# Altium project Stoper_Szymon_Paterak.PrjPcb
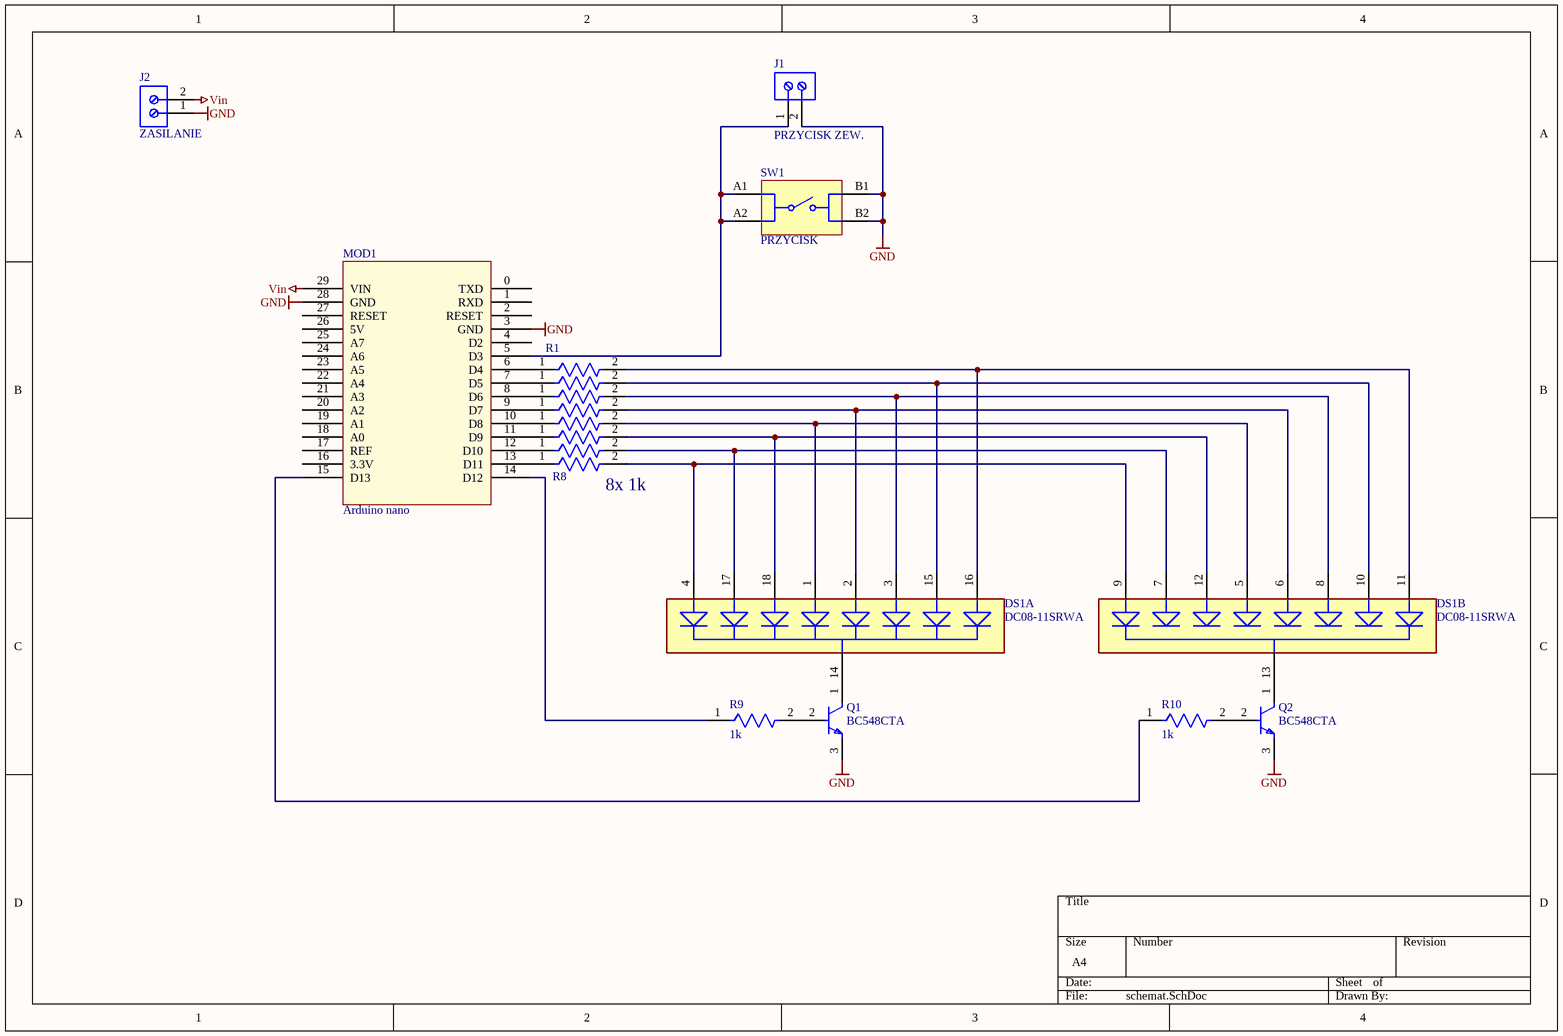
[diagram p0: schemat.SchDoc]
1 sheet, 17 parts. Net scope: global (net labels, ports and power ports of the same name join across sheets).
Board file: PCB.PcbDoc

## Sheet schemat.SchDoc
size A4; SheetNumber: 1; SheetTotal: 1

### Parts
DS1  DC08-11SRWA  [FP-DC08-11SRWA-MFG]  (parts A,B of 2)
J1  PRZYCISK ZEW.  [691102710002]
J2  ZASILANIE  [691102710002]
MOD1  Arduino nano  [Arduino nano]
Q1  BC548CTA  [FP-135AR-MFG]
Q2  BC548CTA  [FP-135AR-MFG]
R1  1k  [FP-CF18-MFG]  (value not drawn)
R2  1k  [FP-CF18-MFG]  (value not drawn)
R3  1k  [FP-CF18-MFG]  (value not drawn)
R4  1k  [FP-CF18-MFG]  (value not drawn)
R5  1k  [FP-CF18-MFG]  (value not drawn)
R6  1k  [FP-CF18-MFG]  (value not drawn)
R7  1k  [FP-CF18-MFG]  (value not drawn)
R8  1k  [FP-CF18-MFG]  (value not drawn)
R9  1k  [FP-CF18-MFG]
R10  1k  [FP-CF18-MFG]
SW1  PRZYCISK  [4304x60437x6]

### Nets
GND: J1.2 J2.1 MOD1.3(GND) MOD1.28(GND) Q1.3(E) Q2.3(E) SW1.B1 SW1.B2
Vin: J2.2 MOD1.29(VIN)
NetDS1_1: DS1.1(Anode_e_Dig1) DS1.5(Anode_e_Dig2) R5.2
NetDS1_2: DS1.2(Anode_d_Dig1) DS1.6(Anode_d_Dig2) R4.2
NetDS1_3: DS1.3(Anode_c_Dig1) DS1.8(Anode_c_Dig2) R3.2
NetDS1_4: DS1.4(Anode_Dp1_Dig1) DS1.9(Anode_Dp2_Dig2) R8.2
NetDS1_7: DS1.7(Anode_g_Dig2) DS1.17(Anode_g_Dig1) R7.2
NetDS1_10: DS1.10(Anode_b_Dig2) DS1.15(Anode_b_Dig1) R2.2
NetDS1_11: DS1.11(Anode_a_Dig2) DS1.16(Anode_a_Dig1) R1.2
NetDS1_12: DS1.12(Anode_f_Dig2) DS1.18(Anode_f_Dig1) R6.2
NetDS1_13: DS1.13(Common_Cathode_Dig2) Q2.1(C)
NetDS1_14: DS1.14(Common_Cathode_Dig1) Q1.1(C)
NetJ1_1: J1.1 MOD1.5(D3) SW1.A1 SW1.A2
NetMOD1_6: MOD1.6(D4) R1.1
NetMOD1_7: MOD1.7(D5) R2.1
NetMOD1_8: MOD1.8(D6) R3.1
NetMOD1_9: MOD1.9(D7) R4.1
NetMOD1_10: MOD1.10(D8) R5.1
NetMOD1_11: MOD1.11(D9) R6.1
NetMOD1_12: MOD1.12(D10) R7.1
NetMOD1_13: MOD1.13(D11) R8.1
NetMOD1_14: MOD1.14(D12) R9.1
NetMOD1_15: MOD1.15(D13) R10.1
NetQ1_2: Q1.2(B) R9.2
NetQ2_2: Q2.2(B) R10.2

Not connected (* = marked no-connect by the designer): MOD1 0(TXD) 1(RXD) 2(RESET) 4(D2) 16(3.3V) 17(REF) 18(A0) 19(A1) 20(A2) 21(A3) 22(A4) 23(A5) 24(A6) 25(A7) 26(5V) 27(RESET)

### Notes on the sheet
- (near R8) 8x 1k

### Library data of the parts
DS1 = CMP-44525-000001-1: DISPLAY 660NM RED 2DIG 0.8" 7SEG; Manufacturer: Kingbright; Reverse Voltage: 5V; Display Type: LED; Wavelength: 640nm; Forward Current: 20mA; Element Config: Common Cathode; Power Dissipation: 75mW; Forward Voltage: 1.85V; Luminous Intensity: 32mcd; Package: DC08-11SRWA; Temperature: -40°C to +85°C; Device Class L2: Displays; ComponentLink2Description: Datasheet; Category: Disp; Digikey Description: DISPLAY 660NM RED 2DIG 0.8" 7SEG; ComponentLink2URL: https://www.kingbrightusa.com/images/catalog/SPEC/DC08-11SRWA.pdf; Lead Free: Yes; Temperature Range High: +85°C; Test Current: 20mA; RoHS: TRUE; Height: 10.25mm; Device Class L1: Optoelectronics; Manufacturer Part Number: DC08-11SRWA; Automotive: No; Temperature Range Low: -40°C; Octopart: https://octopart.com/dc08-11srwa-kingbright-55457135; Mouser Description: LED Displays & Accessories Dual Red 640nm Common Cathode; Device Class L3: LED Displays
J1 J2 = CMP-1502-03258-2: NexarPartId: 8917706; Number of Levels: 1; Number of Positions Per Level: 2; Current: 15A; Voltage: 300V; Pitch: 5.0038mm; Plating: Steel; Stripping Length: -6mm; Wire Gauge (Min): 14AWG; Wire Gauge (Max): 22AWG; Length: 7.5mm; Contact Material: Brass; Contact Plating: Tin; Packaging: Box; Number of Pins: 2; Voltage Rating: 300V; Termination: Screw; Number of Contacts: 2; Color: Blue; Current Rating: 15A; Mount: Through Hole; Max Operating Temperature: 105°C; Min Operating Temperature: -40°C; REACH SVHC: Unknown; Height: 13.4mm; Width: 11.2mm; Housing Material: Nylon; RoHS: Compliant; Wire/Cable Gauge: 22AWG; Lead Pitch: 5mm
MOD1 = Arduino_nano
Q1 Q2 = CMP-00278-84324566-1: BC548CTA Small Signal Bipolar Transistor, 0.1A I(C), 30V V(BR)CEO, 1-Element, NPN, Silicon, TO-92; Manufacturer Lifecycle Status: ACTIVE; Max Power Dissipation: 500mW; Max Collector Current: 100mA; Max Junction Temperature (Tj): 150°C; Transition Frequency: 300MHz; Emitter Base Voltage (VEBO): 5V; hFE Min: 110; Element Configuration: Single; Collector Emitter Saturation Voltage: 250mV; Number of Elements: 1; Height: 4.58mm; Width: 3.86mm; Collector Emitter Voltage (VCEO): 30V; Schedule B: 8541210080, 8541210080; Max Operating Temperature: 150°C; REACH SVHC: No SVHC; Number of Pins: 3; Power Dissipation: 500mW; Frequency: 300MHz; Polarity: NPN; Lead Free: Lead Free; Voltage Rating (DC): 30V; Weight: 240mg; Max Breakdown Voltage: 30V; Current Rating: 100mA; NexarPartId: 84324566; Min Operating Temperature: -65°C; Collector Emitter Breakdown Voltage: 30V; Gain Bandwidth Product: 300MHz; Radiation Hardening: No; Collector Base Voltage (VCBO): 30V; RoHS: Compliant; Contact Plating: Tin; Length: 4.58mm; Lifecycle Status: Production; Case/Package: TO-92; Mount: Through Hole; Max Frequency: 300MHz
R1-R10 = CMP-26528-000002-1: RES 10K OHM 1/8W 5% CF AXIAL; Manufacturer Part Number: CF18JT10K0; Manufacturer: Stackpole Electronics; Power Rating: 0.125W; Temperature Coefficient: 0-500ppm/°C; Resistance: 10kΩ; Voltage Rating: 250V; Value: 10kΩ; Temperature: -55°C to +155°C; Height: 2mm; Lead Free: Yes; Automotive: No; Device Class L2: Resistors; Package: CF18; Series: CF; ComponentLink2Description: Datasheet; Ipc Land Pattern Name: RESAD656W65L360D200; Temperature Range High: +155°C; RoHS: TRUE; Device Class L3: Through-Hole Resistors; Temperature Range Low: -55°C; Device Class L1: Passive Components; Category: Res; Octopart: https://octopart.com/cf18jt10k0-stackpole+electronics-19205642; Composition: Carbon Film; Digikey Description: RES 10K OHM 1/8W 5% CF AXIAL; ComponentLink2URL: http://www.seielect.com/Catalog/SEI-CF_CFM.pdf; Tolerance: 5%
SW1 = CMP-1456-00007-2: NexarPartId: 31136478; Insulation Resistance: 100MΩ; Actuator Length: 800µm; Illumination Type: Illuminated, Non-Illuminated; Switch Function: Off-Mom; Mechanical Life: 500kcycles; Voltage Rating: 12V; Switch Travel: 300µm; Actuator Material: Liquid Crystal Polymer, Polymer; Current Rating: 50mA; Throw Configuration: SPST; Contact Plating: Silver; RoHS: Compliant; Contact Material: Silver, Stainless Steel; Height: 4.3mm; Mount: Through Hole; Min Operating Temperature: -40°C; Termination: PC Pin; Max Operating Temperature: 85°C; REACH SVHC: No SVHC; Packaging: Bulk; Contact Current Rating: 50mA